# Altium schematic sheet PlacaSensor_MPXV7002.SchDoc
size A4; SheetNumber: 1; SheetTotal: 1
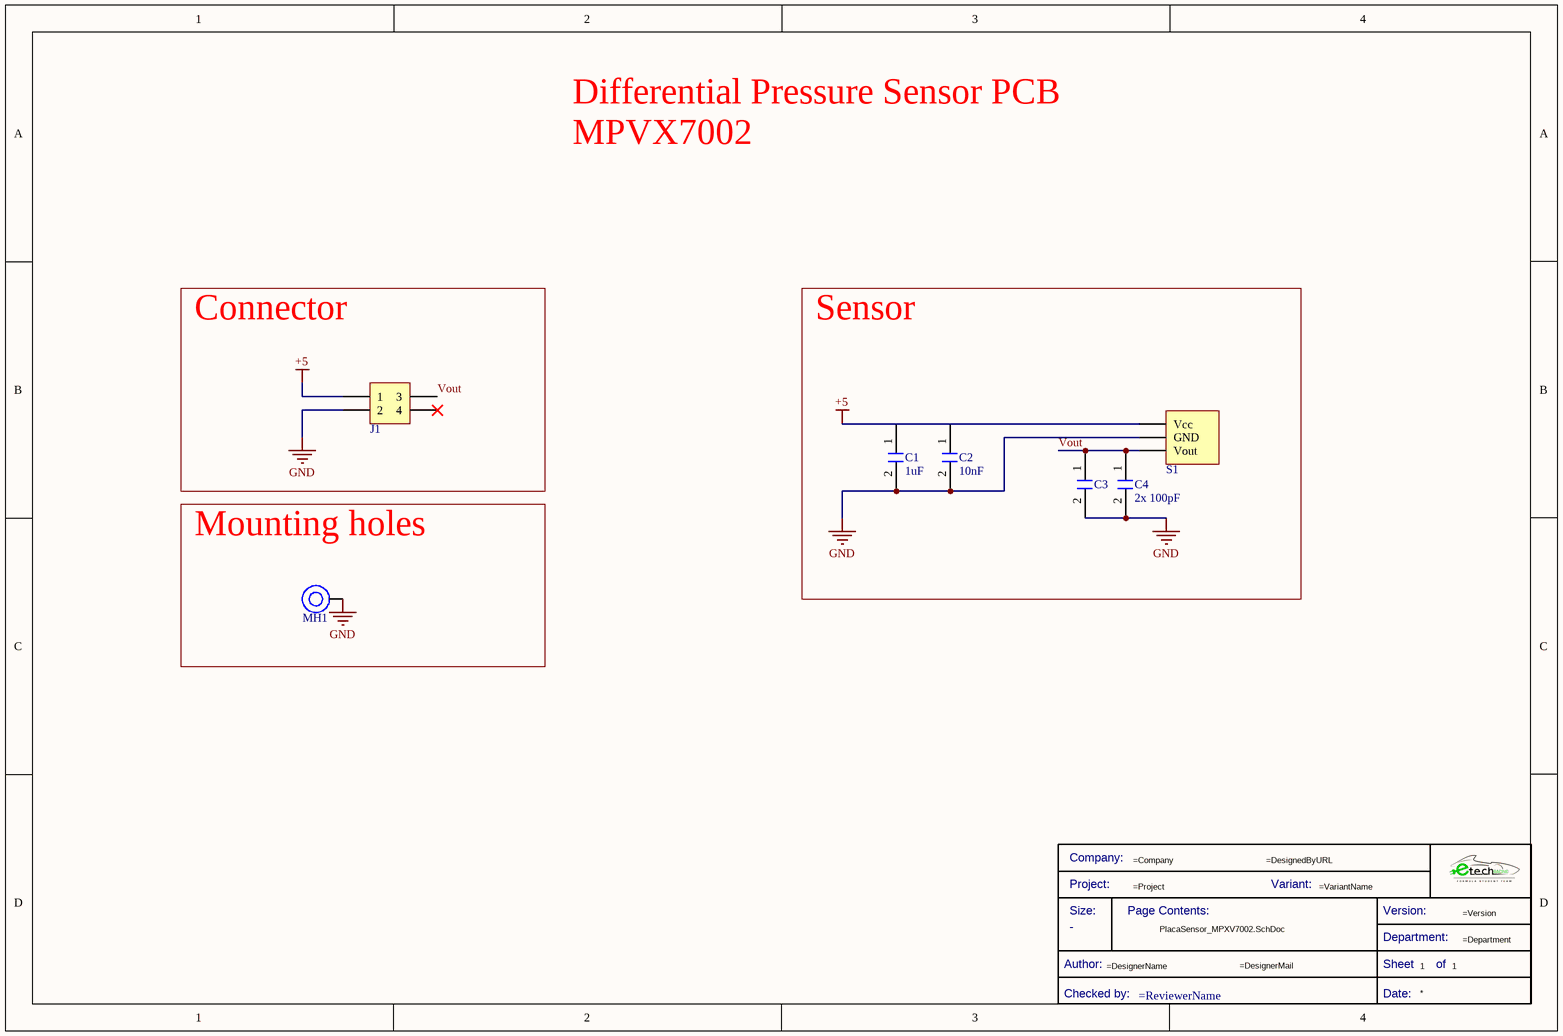
[diagram p0: PlacaSensor_MPXV7002.SchDoc]

## Parts
*  Title Block_template  (value not drawn)  (graphical)
C1  Capacitance: 1uF  [C0805FNPC-R]  (hidden comment: 885012207103)
C2  Capacitance: 10nF  [C0805FNPC-R]  (hidden comment: 885012207092)
C3  885012007057  [C0805FNPC-W]  (value not drawn)
C4  Capacitance: 2x 100pF  [C0805FNPC-W]  (hidden comment: 885012007057)
J1  430450412  [J_MicroFit_2x2_v]  (value not drawn)
MH1  Mounting_Hole_M3  [Mounting_Hole_M3]  (value not drawn)
S1  MPXV7002  [XDCR_MPXV7002DP]  (value not drawn)

## Blocks framed on the sheet
Connector: J1
Sensor: C1-C4 S1
Mounting holes: MH1

## Nets
+5: C1.1 C2.1 J1.1 S1.2(Vcc)
GND: C1.2 C2.2 C3.2 C4.2 J1.2 MH1.1 S1.3(GND)
Vout: C3.1 C4.1 J1.3 S1.4(Vout)

Not connected (* = marked no-connect by the designer): J1 4*

## Notes on the sheet
- Differential Pressure Sensor PCB
- MPVX7002
- (in symbol Title Block_template) Company:; Project:; Variant:; Size:; Page Contents:; Version:; Department:; Author:; Sheet; of; Checked by:; Date:

## Library data of the parts
* = Title Block_template: Standard Title Block; .Creator: GP; Category: Title Block; .PCBcheck: GP; .SCHcheck: GP; Checked by:: =ReviewerName; Size: -
C1 = C1u-50V-0805FNPC-X7R: Multilayer Ceramic Capacitor, Wcap-Csgp Series, 1 F, 10%, X7R, 50 V, 0805 [2012 Metric] Rohs Compliant: Yes; Manufacturer 1: Wurth Electronics; Voltage Rating: 50V; .Creator: GP; Supplier 1: RSComponents; Manufacturer Part Number 1: 885012207103; RoHS: Yes; Category: Ceramic Capacitors; Stock 1: 5100; Pricing 1: 50=0,27200, 250=0,25300, 500=0,22800, 1250=0,20100, 2500=0,17100 (GBP); Mount: Surface Mount; Case/Package: 0805; Case Code (Metric): 2012; Case Code (Imperial): 0805; Min Operating Temperature: -55°C; Max Operating Temperature: 85°C; Packaging: Cut Tape; Dielectric: X7R; Tolerance: 10%; Voltage Rating (DC): 50V; Length: 0.079inch; Width: 0.049inch; Thickness: 0.053inch; REACH SVHC: Unknown; RoHS Compliant: Yes; ComponentLink1URL: http://www.farnell.com/datasheets/1958501.pdf?src-supplier=Farnell; ComponentLink1Description: http://www.farnell.com/datasheets/1958501.pdf?src-supplier=Farnell; ComponentLink2URL: http://www.farnell.com/datasheets/1958501.pdf?src-supplier=Element14; ComponentLink2Description: http://www.farnell.com/datasheets/1958501.pdf?src-supplier=Element14; ComponentLink3URL: https://katalog.we-online.de/pbs/datasheet/885012107003.pdf?src-supplier=Digi-Key; ComponentLink3Description: https://katalog.we-online.de/pbs/datasheet/885012107003.pdf?src-supplier=Digi-Key; ComponentLink4URL: http://www.farnell.com/datasheets/1958501.pdf?src-supplier=Newark; ComponentLink4Description: http://www.farnell.com/datasheets/1958501.pdf?src-supplier=Newark; Supplier Part Number 1: 1813523
C2 = C10n-50V-0805FNPC-X7R: Cap, 0.01ΜF, 50V, 10%, X7R, 0805; Manufacturer 1: Wurth Electronics; .Creator: DR; Supplier 1: RSComponents; Manufacturer Part Number 1: 885012207092; RoHS: Yes; Category: Ceramic Capacitors; Stock 1: 1; Pricing 1: 4000=0,03200, 12000=0,03100 (USD); Mount: Surface Mount; Case/Package: 0805; Case Code (Metric): 2012; Case Code (Imperial): 0805; Min Operating Temperature: -55°C; Max Operating Temperature: 125°C; Packaging: Cut Tape; Voltage Rating: 50V; Dielectric: X7R; Tolerance: 10%; Voltage Rating (DC): 50V; Length: 0.079inch; Width: 0.049inch; Thickness: 0.035inch; REACH SVHC: Unknown; RoHS Compliant: Yes; ComponentLink1URL: http://www.farnell.com/datasheets/1958497.pdf?src-supplier=Farnell; ComponentLink1Description: http://www.farnell.com/datasheets/1958497.pdf?src-supplier=Farnell; ComponentLink2URL: http://www.farnell.com/datasheets/1958497.pdf?src-supplier=Element14; ComponentLink2Description: http://www.farnell.com/datasheets/1958497.pdf?src-supplier=Element14; ComponentLink3URL: http://www.farnell.com/datasheets/1958497.pdf?src-supplier=Newark; ComponentLink3Description: http://www.farnell.com/datasheets/1958497.pdf?src-supplier=Newark; ComponentLink4URL: https://katalog.we-online.de/pbs/datasheet/885012207092.pdf?src-supplier=Digi-Key; ComponentLink4Description: https://katalog.we-online.de/pbs/datasheet/885012207092.pdf?src-supplier=Digi-Key; Supplier Part Number 1: 1813941
C3 = C100p-50V-0805FNPC-C0G/NP0: Multilayer Ceramic Capacitor, Wcap-Csgp Series, 100 Pf, 5%, C0G / Np0, 50 V, 0805 [2012 Metric] Rohs Compliant: Yes; Manufacturer: Wurth Electronics; Voltage Rating: 50V; .Creator: DR; Capacitance: 100pF; Supplier 1: RSComponents; Manufacturer Part Number: 885012007057; RoHS: Yes; Category: Ceramic Capacitors; Stock 1: 1; Pricing 1: 4000=0,03900, 12000=0,03800 (USD); Mount: Surface Mount; Case/Package: 0805; Case Code (Metric): 2012; Case Code (Imperial): 0805; Min Operating Temperature: -55°C; Max Operating Temperature: 125°C; Packaging: Cut Tape; Dielectric: C0G; Tolerance: 5%; Voltage Rating (DC): 50V; Length: 0.079inch; Width: 0.049inch; Thickness: 0.035inch; REACH SVHC: Unknown; RoHS Compliant: Yes; ComponentLink1URL: http://www.farnell.com/datasheets/1958443.pdf?src-supplier=Farnell; ComponentLink1Description: http://www.farnell.com/datasheets/1958443.pdf?src-supplier=Farnell; ComponentLink2URL: https://katalog.we-online.de/pbs/datasheet/885012007057.pdf?src-supplier=Digi-Key; ComponentLink2Description: https://katalog.we-online.de/pbs/datasheet/885012007057.pdf?src-supplier=Digi-Key; ComponentLink3URL: http://www.farnell.com/datasheets/1958443.pdf?src-supplier=Element14; ComponentLink3Description: http://www.farnell.com/datasheets/1958443.pdf?src-supplier=Element14; ComponentLink4URL: http://www.farnell.com/datasheets/1958443.pdf?src-supplier=Newark; ComponentLink4Description: http://www.farnell.com/datasheets/1958443.pdf?src-supplier=Newark; ComponentLink5Description: Where buy it; ComponentLink5URL: https://www.we-online.com/catalog/en/WCAP-CSGP-50VDC#885012007057; Supplier Part Number 1: 1813930
C4 = C100p-50V-0805FNPC-C0G/NP0: Multilayer Ceramic Capacitor, Wcap-Csgp Series, 100 Pf, 5%, C0G / Np0, 50 V, 0805 [2012 Metric] Rohs Compliant: Yes; Manufacturer: Wurth Electronics; Voltage Rating: 50V; .Creator: DR; Supplier 1: RSComponents; Manufacturer Part Number: 885012007057; RoHS: Yes; Category: Ceramic Capacitors; Stock 1: 1; Pricing 1: 4000=0,03900, 12000=0,03800 (USD); Mount: Surface Mount; Case/Package: 0805; Case Code (Metric): 2012; Case Code (Imperial): 0805; Min Operating Temperature: -55°C; Max Operating Temperature: 125°C; Packaging: Cut Tape; Dielectric: C0G; Tolerance: 5%; Voltage Rating (DC): 50V; Length: 0.079inch; Width: 0.049inch; Thickness: 0.035inch; REACH SVHC: Unknown; RoHS Compliant: Yes; ComponentLink1URL: http://www.farnell.com/datasheets/1958443.pdf?src-supplier=Farnell; ComponentLink1Description: http://www.farnell.com/datasheets/1958443.pdf?src-supplier=Farnell; ComponentLink2URL: https://katalog.we-online.de/pbs/datasheet/885012007057.pdf?src-supplier=Digi-Key; ComponentLink2Description: https://katalog.we-online.de/pbs/datasheet/885012007057.pdf?src-supplier=Digi-Key; ComponentLink3URL: http://www.farnell.com/datasheets/1958443.pdf?src-supplier=Element14; ComponentLink3Description: http://www.farnell.com/datasheets/1958443.pdf?src-supplier=Element14; ComponentLink4URL: http://www.farnell.com/datasheets/1958443.pdf?src-supplier=Newark; ComponentLink4Description: http://www.farnell.com/datasheets/1958443.pdf?src-supplier=Newark; ComponentLink5Description: Where buy it; ComponentLink5URL: https://www.we-online.com/catalog/en/WCAP-CSGP-50VDC#885012007057; Supplier Part Number 1: 1813930
J1 = J_MicroFit_2x2: Header 2 Row Vertical Polarizing Peg 4 Pin Tin Plate SMT/Glow Wire Kinked Leads; Manufacturer 1: Molex; Manufacturer Part Number 1: 43045-0412; .Creator: DR; Supplier 1: Arrow Electronics; RoHS: Yes; Category: Headers and Wire Housings; Stock 1: 54122; Pricing 1: 1=1,24720, 10=1,02970, 80=0,85390, 2232=0,63810, 6696=0,59030, 11160=0,55550 (USD); ComponentLink1URL: https://datasheet.ciiva.com/19462/883368-19462265.pdf?src-supplier=Jameco; ComponentLink1Description: https://datasheet.ciiva.com/19462/883368-19462265.pdf?src-supplier=Jameco; ComponentLink2URL: https://datasheet.ciiva.com/5158/0430450412-pcb-headers-142874-5158187.pdf?src-supplier=Mouser; ComponentLink2Description: https://datasheet.ciiva.com/5158/0430450412-pcb-headers-142874-5158187.pdf?src-supplier=Mouser; ComponentLink3URL: https://datasheet.ciiva.com/30095/176640430450412-pcb-headers-30095929.pdf?src-supplier=Onlinecomponents.com; ComponentLink3Description: https://datasheet.ciiva.com/30095/176640430450412-pcb-headers-30095929.pdf?src-supplier=Onlinecomponents.com; ComponentLink4URL: https://datasheet.ciiva.com/11747/0900766b800bd7d2-11747137.pdf?src-supplier=RSComponents; ComponentLink4Description: https://datasheet.ciiva.com/11747/0900766b800bd7d2-11747137.pdf?src-supplier=RSComponents; ComponentLink5URL: https://datasheet.ciiva.com/26916/getdatasheetpartid-253008-26916516.pdf?src-supplier=Verical; ComponentLink5Description: https://datasheet.ciiva.com/26916/getdatasheetpartid-253008-26916516.pdf?src-supplier=Verical; ComponentLink6URL: https://datasheet.ciiva.com/22637/1928349-22637530.pdf?src-supplier=Element14; ComponentLink6Description: https://datasheet.ciiva.com/22637/1928349-22637530.pdf?src-supplier=Element14; ComponentLink7URL: https://datasheet.ciiva.com/9468/0430450412-pcb-headers-9468485.pdf?src-supplier=Avnet; ComponentLink7Description: https://datasheet.ciiva.com/9468/0430450412-pcb-headers-9468485.pdf?src-supplier=Avnet; Supplier Part Number 1: 43045-0412